# Altium schematic sheet 5V_regulator_V2.SchDoc
size A4; SheetNumber: 4; SheetTotal: 4
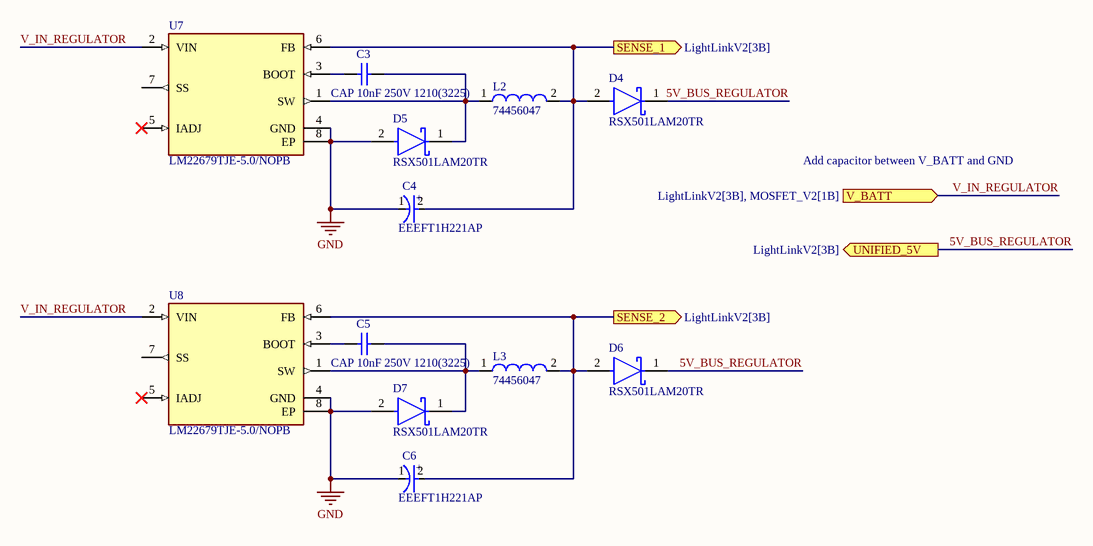
[diagram p0: 5V_regulator_V2.SchDoc]

## Parts
C3  CAP 10nF 250V 1210(3225)  [CAPC1210(3225)100_N]
C4  EEEFT1H221AP  [FP-FTF-MFG]
C5  CAP 10nF 250V 1210(3225)  [CAPC1210(3225)100_N]
C6  EEEFT1H221AP  [FP-FTF-MFG]
D4  RSX501LAM20TR  [FP-PMDTM-MFG]
D5  RSX501LAM20TR  [FP-PMDTM-MFG]
D6  RSX501LAM20TR  [FP-PMDTM-MFG]
D7  RSX501LAM20TR  [FP-PMDTM-MFG]
L2  74456047  [WE-PD4-L]
L3  74456047  [WE-PD4-L]
U7  LM22679TJE-5.0/NOPB  [FP-NDR0007A-MFG]
U8  LM22679TJE-5.0/NOPB  [FP-NDR0007A-MFG]

## Ports
SENSE_1 (out, see LightLinkV2[3B]), SENSE_2 (out, see LightLinkV2[3B]), UNIFIED_5V (out, see LightLinkV2[3B]), V_BATT (in, see LightLinkV2[3B], MOSFET_V2[1B])

## Nets
GND: C4.1(C) C6.1(C) D5.2(A) D7.2(A) U7.4(GND) U7.8(EP) U8.4(GND) U8.8(EP)
5V_BUS_REGULATOR: D4.1(C) D6.1(C) ; port UNIFIED_5V
SENSE_1: C4.2(A) D4.2(A) L2.2 U7.6(FB) ; port SENSE_1
SENSE_2: C6.2(A) D6.2(A) L3.2 U8.6(FB) ; port SENSE_2
V_IN_REGULATOR: U7.2(VIN) U8.2(VIN) ; port V_BATT
NetC3_1: C3.1 U7.3(BOOT)
NetC3_2: C3.2 D5.1(C) L2.1 U7.1(SW)
NetC5_1: C5.1 U8.3(BOOT)
NetC5_2: C5.2 D7.1(C) L3.1 U8.1(SW)

Not connected (* = marked no-connect by the designer): U7 5(IADJ)* 7(SS); U8 5(IADJ)* 7(SS)

## Notes on the sheet
- Add capacitor between V_BATT and GND
- (in symbol CMP-05427-000092-1) +

## Library data of the parts
C3 C5 = CMP-1038-01142-1: CAP 10nF 250V ±10% 1210 (3225 Metric) Thickness 1mm SMD; Case-EIA: 1210; Case-Metric: 3225; Tolerance: Â±10%; Rated Voltage: 250 V; Max Thickness: 1 mm; Value: 10nF; Technology: SMT
C4 C6 = CMP-05427-000092-1: CAP ALUM 220UF 20% 50V SMD; Ripple Current (AC): 670mA; Dielectric Material: Aluminium; Life (Hours): 2000Hour; Leakage Current: 110uA; Lead Diameter: 0.9mm; ESR (Equivalent Series Resistance): 180mR; REACH SVHC: No SVHC; Voltage Rating (DC): 50V; Radiation Hardening: No; Capacitance: 220uF; Length: 10.2mm; Construction: Cylindrical; Case/Package: Radial; Series: FT; Lead Free: Lead Free; Voltage Rating: 50V; Tolerance: 20%; Contact Plating: Tin; Number of Pins: 2; Height - Seated (Max): 0.413inch; RoHS Compliant: Yes; Diameter: 8mm; Ripple Current: 670mA; Lead Pitch: 3.1mm; Termination: SMD/SMT; Mount: Surface Mount; Min Operating Temperature: -55°C; Max Operating Temperature: 105°C; Voltage: 50V; Height: 10.2mm; Package Quantity: 500; Packaging: Tape and Reel
D4-D7 = CMP-08971-000008-1: DIODE SCHOTTKY 20V 5A PMDTM; Manufacturer: Rohm; Max Surge Forward Current: 100A; Max Junction Temp: +125°C; Max Repetitive Reverse Voltage: 25V; Peak Reverse Current: 500uA; Description: Diode Schottky 20V 5A Surface Mount PMDTM; Automotive: No; Digikey Description: DIODE SCHOTTKY 20V 5A PMDTM; Temperature Range High: +125°C; Height: 1.05mm; Octopart: https://octopart.com/rsx501lam20tr-rohm-82270774; Lead Free: Yes; ComponentLink2URL: https://fscdn.rohm.com/en/products/databook/datasheet/discrete/diode/schottky_barrier/rsx501lam20tr-e.pdf; Device Class L2: Diodes; ComponentLink2Description: Datasheet; Device Class L1: Discrete Semiconductors; RoHS: TRUE; Reverse Voltage: 20V; Package: PMDTM; Category: Diode; Temperature: to +125°C; Device Class L3: Schottky Diodes; Manufacturer Part Number: RSX501LAM20TR; Forward Current: 5A
L2 L3 = CMP-0227-00798-1: SMD-Power Inductor WE-PD4, L = 4.70 µH; Inductance: 4.70 ÂµH; PackageReference: WE-PD4-L; ComponentLink2Description: Datasheet; ComponentLink1URL: http://www.we-online.com; DatasheetVersion: ver 2, Sep-2006; ComponentLink2URL: http://www.we-online.de/katalog/media/pdf/74456047.pdf; PackageVersion: 2006; PackageDescription: SMD Inductor, 2-Leads, Body 12.7 x 10.0 mm; ComponentLink1Description: Manufacturer Link
U7 U8 = CMP-0069-00304-3: IC REG BUCK 5V 5A TO263-7; Efficiency: 90%; Number of Outputs: 1; Max Input Voltage: 42V; Min Input Voltage: 4.5V; Frequency: 500kHz; Min Supply Voltage: 8V; Output Type: Fixed; Quiescent Current: 3.4mA; Synchronous Rectifier: No; Output Current: 5A; Number of Pins: 7; REACH SVHC: No SVHC; Contact Plating: Tin; Max Operating Temperature: 125°C; Series: SIMPLE SWITCHER®; RoHS Compliant: Yes; Case/Package: TO-263; Max Supply Voltage: 42V; Output Voltage: 5V; Max Output Current: 5A; Height: 2mm; Package Quantity: 250; Max Output Voltage: 5V; Radiation Hardening: No; Width: 9.85mm; Mount: Surface Mount; Length: 10.16mm; Packaging: Cut Tape; Min Operating Temperature: -40°C; Switching Frequency: 500kHz; Termination: SMD/SMT; Nominal Output Voltage: 5V; Lead Free: Lead Free